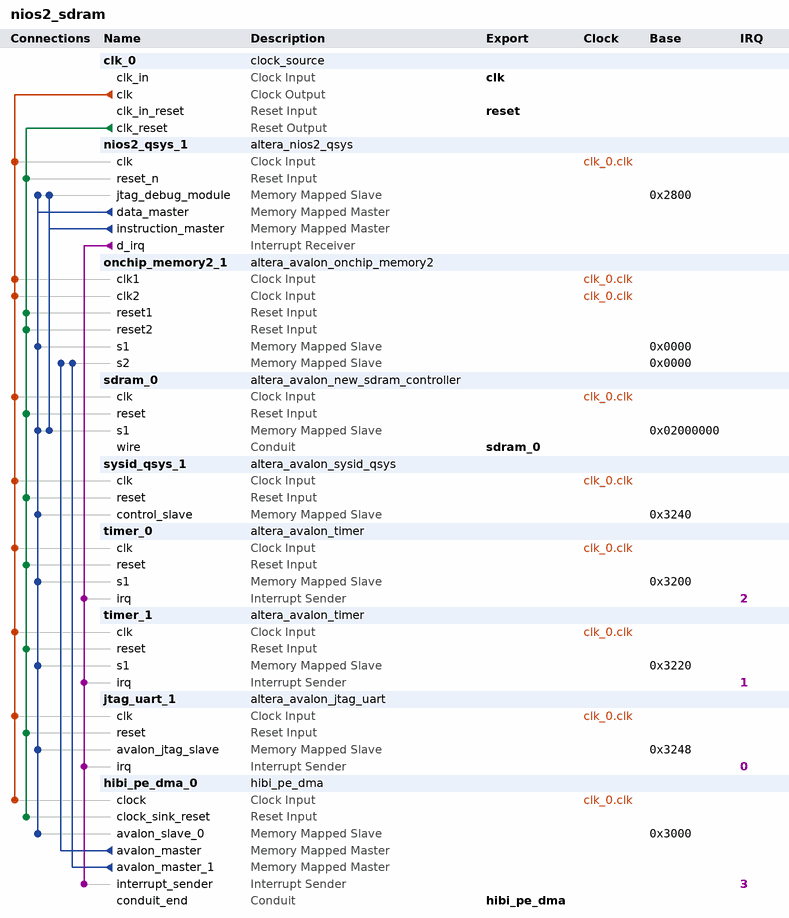
[diagram p0: system contents]
# Platform Designer (Qsys) system nios2_sdram, Cyclone II EP2C35F672C6
# Parameters at their usual value, and those the tool derives, are not listed.
package require -exact qsys 12.1
create_system nios2_sdram
set_project_property DEVICE_FAMILY {Cyclone II}
set_project_property DEVICE EP2C35F672C6

add_instance clk_0 clock_source 12.1
set_instance_parameter_value clk_0 clockFrequency 50000000

add_instance nios2_qsys_1 altera_nios2_qsys 12.1
set_instance_parameter_value nios2_qsys_1 cpuID 16777216
set_instance_parameter_value nios2_qsys_1 resetSlave sdram_0.s1
set_instance_parameter_value nios2_qsys_1 exceptionSlave sdram_0.s1
set_instance_parameter_value nios2_qsys_1 breakSlave nios2_qsys_1.jtag_debug_module
set_instance_parameter_value nios2_qsys_1 impl Fast
set_instance_parameter_value nios2_qsys_1 icache_size 4096

add_instance onchip_memory2_1 altera_avalon_onchip_memory2 12.1
set_instance_parameter_value onchip_memory2_1 dataWidth 32
set_instance_parameter_value onchip_memory2_1 dualPort true
set_instance_parameter_value onchip_memory2_1 initMemContent true
set_instance_parameter_value onchip_memory2_1 initializationFileName onchip_memory2_1
set_instance_parameter_value onchip_memory2_1 memorySize 8192

add_instance sdram_0 altera_avalon_new_sdram_controller 12.1
set_instance_parameter_value sdram_0 TAC 5.5
set_instance_parameter_value sdram_0 TRCD 20.0
set_instance_parameter_value sdram_0 TRP 20.0
set_instance_parameter_value sdram_0 casLatency 3
set_instance_parameter_value sdram_0 columnWidth 8
set_instance_parameter_value sdram_0 dataWidth 16
set_instance_parameter_value sdram_0 generateSimulationModel false
set_instance_parameter_value sdram_0 model custom
set_instance_parameter_value sdram_0 numberOfBanks 4
set_instance_parameter_value sdram_0 numberOfChipSelects 1
set_instance_parameter_value sdram_0 powerUpDelay 100.0
set_instance_parameter_value sdram_0 refreshPeriod 15.625
set_instance_parameter_value sdram_0 rowWidth 12

add_instance sysid_qsys_1 altera_avalon_sysid_qsys 12.1
set_instance_parameter_value sysid_qsys_1 id 16777216

add_instance timer_0 altera_avalon_timer 12.1
set_instance_parameter_value timer_0 period 1
set_instance_parameter_value timer_0 periodUnits MSEC
set_instance_parameter_value timer_0 timerPreset CUSTOM

add_instance timer_1 altera_avalon_timer 12.1
set_instance_parameter_value timer_1 period 1
set_instance_parameter_value timer_1 periodUnits MSEC
set_instance_parameter_value timer_1 timerPreset CUSTOM

add_instance jtag_uart_1 altera_avalon_jtag_uart 12.1
set_instance_parameter_value jtag_uart_1 simInteractiveOptions INTERACTIVE_ASCII_OUTPUT

add_instance hibi_pe_dma_0 hibi_pe_dma 1.0
set_instance_parameter_value hibi_pe_dma_0 data_width_g 32
set_instance_parameter_value hibi_pe_dma_0 addr_width_g 32
set_instance_parameter_value hibi_pe_dma_0 words_width_g 16
set_instance_parameter_value hibi_pe_dma_0 n_stream_chans_g 2
set_instance_parameter_value hibi_pe_dma_0 n_packet_chans_g 2
set_instance_parameter_value hibi_pe_dma_0 n_chans_bits_g 3
set_instance_parameter_value hibi_pe_dma_0 hibi_addr_cmp_lo_g 0
set_instance_parameter_value hibi_pe_dma_0 hibi_addr_cmp_hi_g 31

# connections
add_connection clk_0.clk hibi_pe_dma_0.clock clock
add_connection clk_0.clk jtag_uart_1.clk clock
add_connection clk_0.clk nios2_qsys_1.clk clock
add_connection clk_0.clk onchip_memory2_1.clk1 clock
add_connection clk_0.clk onchip_memory2_1.clk2 clock
add_connection clk_0.clk sdram_0.clk clock
add_connection clk_0.clk sysid_qsys_1.clk clock
add_connection clk_0.clk timer_0.clk clock
add_connection clk_0.clk timer_1.clk clock
add_connection clk_0.clk_reset hibi_pe_dma_0.clock_sink_reset reset
add_connection clk_0.clk_reset jtag_uart_1.reset reset
add_connection clk_0.clk_reset nios2_qsys_1.reset_n reset
add_connection clk_0.clk_reset onchip_memory2_1.reset1 reset
add_connection clk_0.clk_reset onchip_memory2_1.reset2 reset
add_connection clk_0.clk_reset sdram_0.reset reset
add_connection clk_0.clk_reset sysid_qsys_1.reset reset
add_connection clk_0.clk_reset timer_0.reset reset
add_connection clk_0.clk_reset timer_1.reset reset
add_connection hibi_pe_dma_0.avalon_master onchip_memory2_1.s2 avalon
set_connection_parameter_value hibi_pe_dma_0.avalon_master/onchip_memory2_1.s2 baseAddress 0x0000
add_connection hibi_pe_dma_0.avalon_master_1 onchip_memory2_1.s2 avalon
set_connection_parameter_value hibi_pe_dma_0.avalon_master_1/onchip_memory2_1.s2 baseAddress 0x0000
add_connection nios2_qsys_1.data_master hibi_pe_dma_0.avalon_slave_0 avalon
set_connection_parameter_value nios2_qsys_1.data_master/hibi_pe_dma_0.avalon_slave_0 baseAddress 0x3000
add_connection nios2_qsys_1.data_master jtag_uart_1.avalon_jtag_slave avalon
set_connection_parameter_value nios2_qsys_1.data_master/jtag_uart_1.avalon_jtag_slave baseAddress 0x3248
add_connection nios2_qsys_1.data_master nios2_qsys_1.jtag_debug_module avalon
set_connection_parameter_value nios2_qsys_1.data_master/nios2_qsys_1.jtag_debug_module baseAddress 0x2800
add_connection nios2_qsys_1.data_master onchip_memory2_1.s1 avalon
set_connection_parameter_value nios2_qsys_1.data_master/onchip_memory2_1.s1 baseAddress 0x0000
add_connection nios2_qsys_1.data_master sdram_0.s1 avalon
set_connection_parameter_value nios2_qsys_1.data_master/sdram_0.s1 baseAddress 0x02000000
add_connection nios2_qsys_1.data_master sysid_qsys_1.control_slave avalon
set_connection_parameter_value nios2_qsys_1.data_master/sysid_qsys_1.control_slave baseAddress 0x3240
add_connection nios2_qsys_1.data_master timer_0.s1 avalon
set_connection_parameter_value nios2_qsys_1.data_master/timer_0.s1 baseAddress 0x3200
add_connection nios2_qsys_1.data_master timer_1.s1 avalon
set_connection_parameter_value nios2_qsys_1.data_master/timer_1.s1 baseAddress 0x3220
add_connection nios2_qsys_1.instruction_master nios2_qsys_1.jtag_debug_module avalon
set_connection_parameter_value nios2_qsys_1.instruction_master/nios2_qsys_1.jtag_debug_module baseAddress 0x2800
add_connection nios2_qsys_1.instruction_master sdram_0.s1 avalon
set_connection_parameter_value nios2_qsys_1.instruction_master/sdram_0.s1 baseAddress 0x02000000
add_connection nios2_qsys_1.d_irq hibi_pe_dma_0.interrupt_sender interrupt
set_connection_parameter_value nios2_qsys_1.d_irq/hibi_pe_dma_0.interrupt_sender irqNumber 3
add_connection nios2_qsys_1.d_irq jtag_uart_1.irq interrupt
set_connection_parameter_value nios2_qsys_1.d_irq/jtag_uart_1.irq irqNumber 0
add_connection nios2_qsys_1.d_irq timer_0.irq interrupt
set_connection_parameter_value nios2_qsys_1.d_irq/timer_0.irq irqNumber 2
add_connection nios2_qsys_1.d_irq timer_1.irq interrupt
set_connection_parameter_value nios2_qsys_1.d_irq/timer_1.irq irqNumber 1

# exported interfaces
add_interface clk clock sink
set_interface_property clk EXPORT_OF clk_0.clk_in
add_interface reset reset sink
set_interface_property reset EXPORT_OF clk_0.clk_in_reset
add_interface sdram_0 conduit end
set_interface_property sdram_0 EXPORT_OF sdram_0.wire
add_interface hibi_pe_dma conduit end
set_interface_property hibi_pe_dma EXPORT_OF hibi_pe_dma_0.conduit_end

save_system nios2_sdram.qsys
